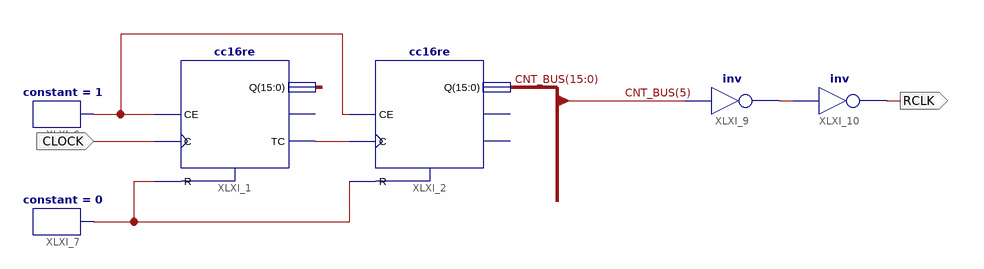
[diagram p0: schematic sheet 1]
// Xilinx ISE schematic TESTDIVIDER.sch (spartan3a) as structural Verilog: 6 symbols, 2 ports
module TESTDIVIDER (
  input  CLOCK,
  output RCLK
);

  wire XLXN_1, XLXN_5, XLXN_12, XLXN_18;
  wire [15:0] CNT_BUS, XLXN_17;

  cc16re XLXI_1 (.C(CLOCK), .CE(XLXN_12), .R(XLXN_5), .Q(XLXN_17), .TC(XLXN_1));  // open: CEO
  cc16re XLXI_2 (.C(XLXN_1), .CE(XLXN_12), .R(XLXN_5), .Q(CNT_BUS));  // open: CEO, TC
  constant #(.CValue("0")) XLXI_7 (.O(XLXN_5));
  constant #(.CValue("1")) XLXI_6 (.O(XLXN_12));
  not XLXI_9 (XLXN_18, CNT_BUS[5]);
  not XLXI_10 (RCLK, XLXN_18);
endmodule
